# EAGLE design M7347B (EAGLE 6.6.0)
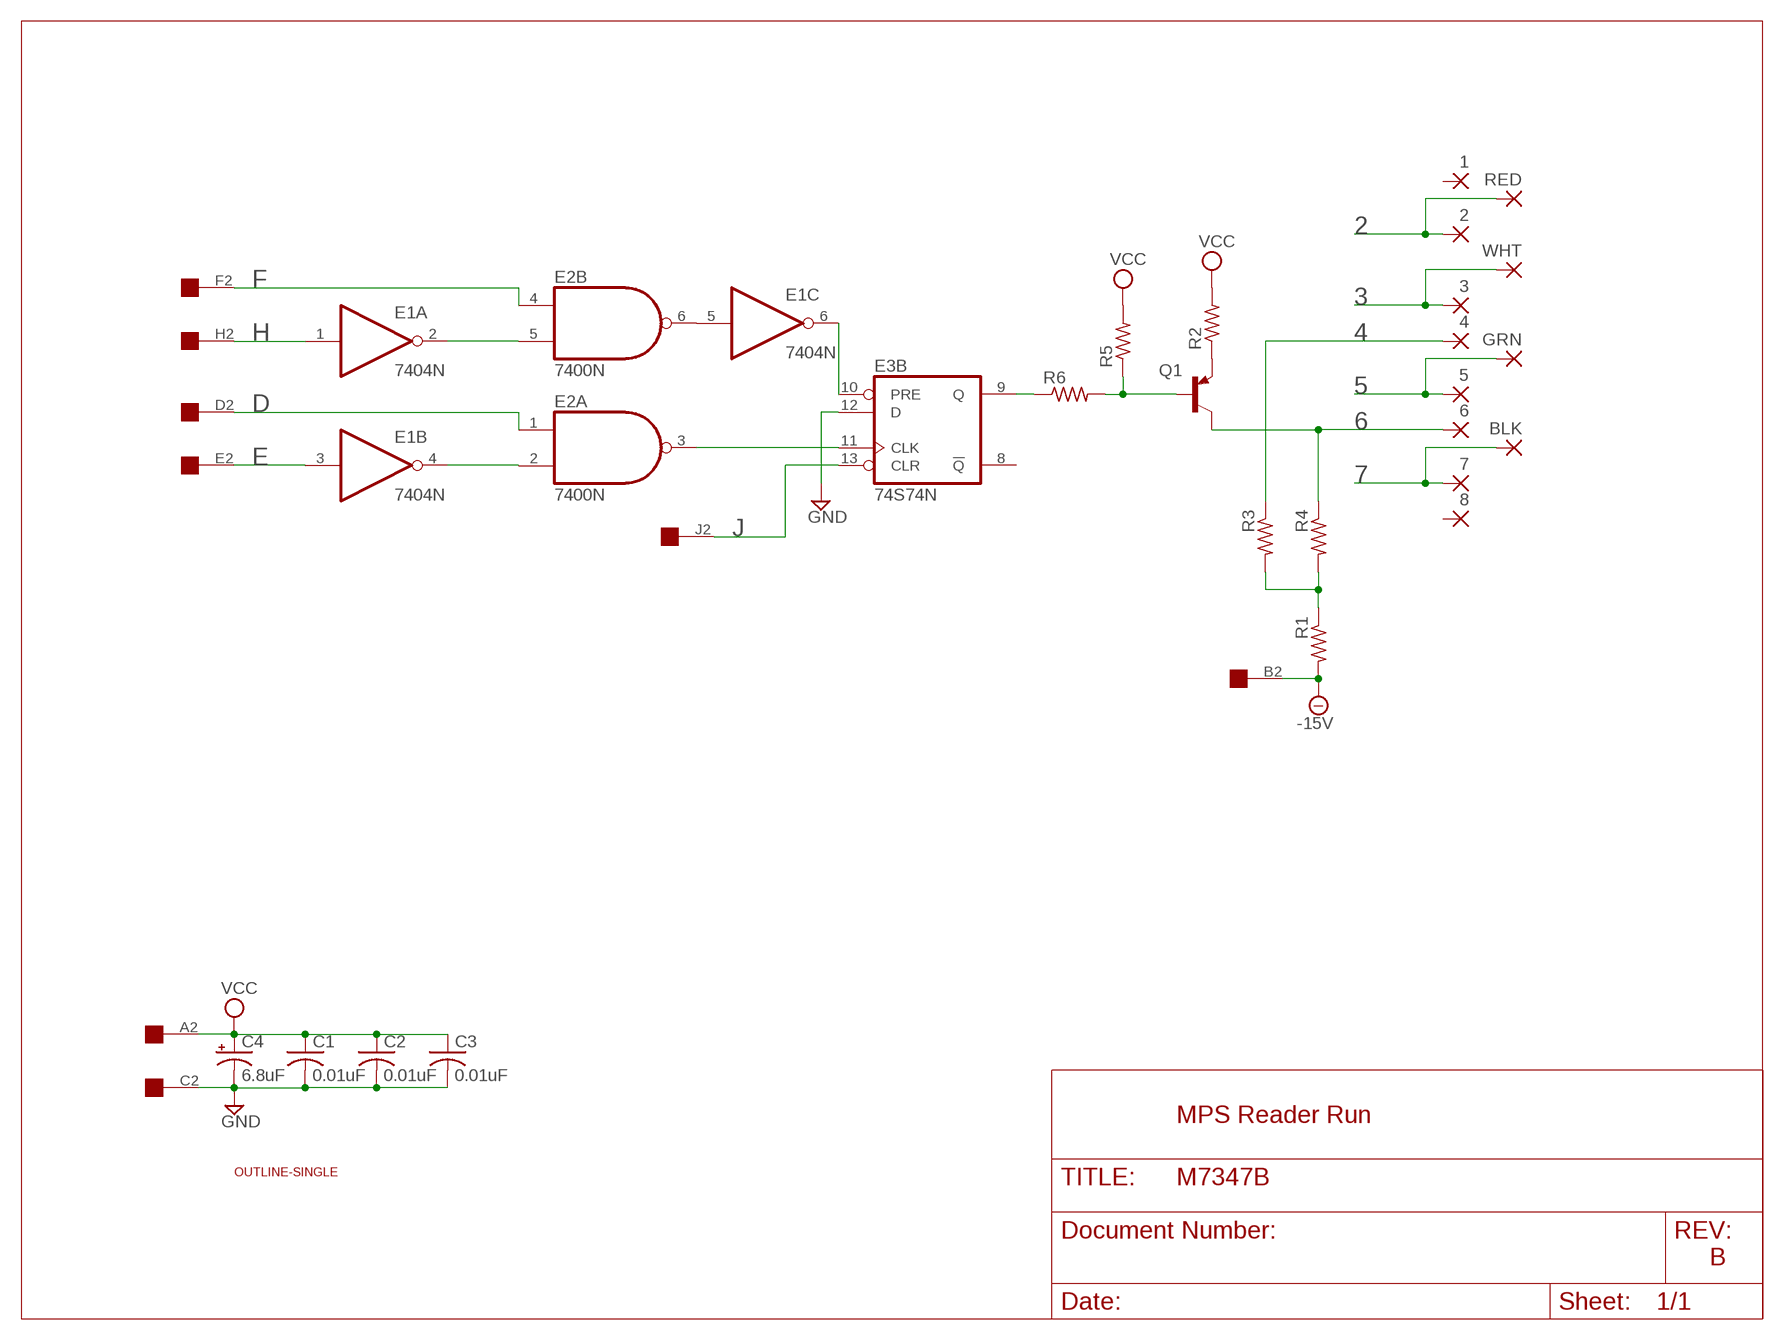
[diagram p0: schematic, sheet 1]

## Parts
1  2,15/1,0  [2,15/1,0]
2  2,15/1,0  [2,15/1,0]
3  2,15/1,0  [2,15/1,0]
4  2,15/1,0  [2,15/1,0]
5  2,15/1,0  [2,15/1,0]
6  2,15/1,0  [2,15/1,0]
7  2,15/1,0  [2,15/1,0]
8  2,15/1,0  [2,15/1,0]
BLK  2,15/1,0  [2,15/1,0]
C1  0.01uF  C-US050-025X075  [C050-025X075]
C2  0.01uF  C-US050-025X075  [C050-025X075]
C3  0.01uF  C-US050-025X075  [C050-025X075]
C4  6.8uF  CPOL-USE20-8AXIAL  [E12-8]
E1  7404N  [DIL14]
E2  7400N  [DIL14]
E3  74S74N  [DIL14]
GRN  2,15/1,0  [2,15/1,0]
Q1  -PNP-TO5  [TO5]
R1  R-US_0207/10  [0207/10]
R2  R-US_0207/10  [0207/10]
R3  R-US_0207/10  [0207/10]
R4  R-US_0207/10  [0207/10]
R5  R-US_0207/10  [0207/10]
R6  R-US_0207/10  [0207/10]
RED  2,15/1,0  [2,15/1,0]
U$1  EDGE-1  [EDGE-CON1]
U$2  OUTLINE-SINGLE  [SINGLE]
WHT  2,15/1,0  [2,15/1,0]

## Nets
2: 2.1(P) RED.1(P)
3: 3.1(P) WHT.1(P)
4: 4.1(P) R3.1
5: 5.1(P) GRN.1(P)
6: 6.1(P) Q1.3(C) R4.1
7: 7.1(P) BLK.1(P)
-15V [supply]: R1.2 U$1.B2
D: E2.1(A:I0) U$1.D2
E: E1.3(B:I) U$1.E2
F: E2.4(B:I0) U$1.F2
GND [supply]: C1.2 C2.2 C3.2 C4.- E3.12(B:D) U$1.C2
H: E1.1(A:I) U$1.H2
J: E3.13(B:CLR) U$1.J2
N$1: Q1.2(B) R5.1 R6.2
N$2: E1.2(A:O) E2.5(B:I1)
N$3: E1.4(B:O) E2.2(A:I1)
N$4: E1.6(C:O) E3.10(B:PRE)
N$6: E2.3(A:O) E3.11(B:CLK)
N$9: E1.5(C:I) E2.6(B:O)
N$26: E3.9(B:Q) R6.1
N$43: R1.1 R3.2 R4.2
N$44: Q1.1(E) R2.1
VCC [supply]: C1.1 C2.1 C3.1 C4.+ R2.2 R5.2 U$1.A2
Unconnected: 1.1(P) 8.1(P) E1.8(D:O) E1.9(D:I) E1.10(E:O) E1.11(E:I) E1.12(F:O) E1.13(F:I) E2.8(C:O) E2.9(C:I0) E2.10(C:I1) E2.11(D:O) E2.12(D:I0) E2.13(D:I1) E3.1(A:CLR) E3.2(A:D) E3.3(A:CLK) E3.4(A:PRE) E3.5(A:Q) E3.6(A:!Q) E3.8(B:!Q) U$1.K2 U$1.L2 U$1.M2 U$1.N2 U$1.P2 U$1.R2 U$1.S2 U$1.T2 U$1.U2 U$1.V2

## Notes on the sheet
- MPS Reader Run
- B

## Power pins joined to a net without a drawn wire
GND: E1.7(P:GND) E2.7(P:GND) E3.7(P:GND)
VCC: E1.14(P:VCC) E2.14(P:VCC) E3.14(P:VCC)

## Library data of the parts
1-8 BLK GRN RED WHT = wirepad:2,15/1,0: THROUGH-HOLE PAD
C1-C3 = rcl:C-US: CAPACITOR, American symbol
C4 = dec-con:CPOL-USE20-8AXIAL: A 0.8 inch electrolytic.
E1 = 74xx-us:74*04: Hex INVERTER
E2 = 74xx-us:74*00: Quad 2-input NAND gate
E3 = 74xx-us:74*74: Dual D type positive edge triggered FLIP FLOP, preset and clear
Q1 = transistor:*-PNP-: PNP Transistror
R1-R6 = rcl:R-US_: RESISTOR, American symbol
U$1 = dec-con:EDGE-1: Single-Sided DEC Edge Connector -- (side 2)
U$2 = dec-con:OUTLINE-*: Board outlines for DEC boards.

## Net classes
1 supply: width 0.813 mm

## Board
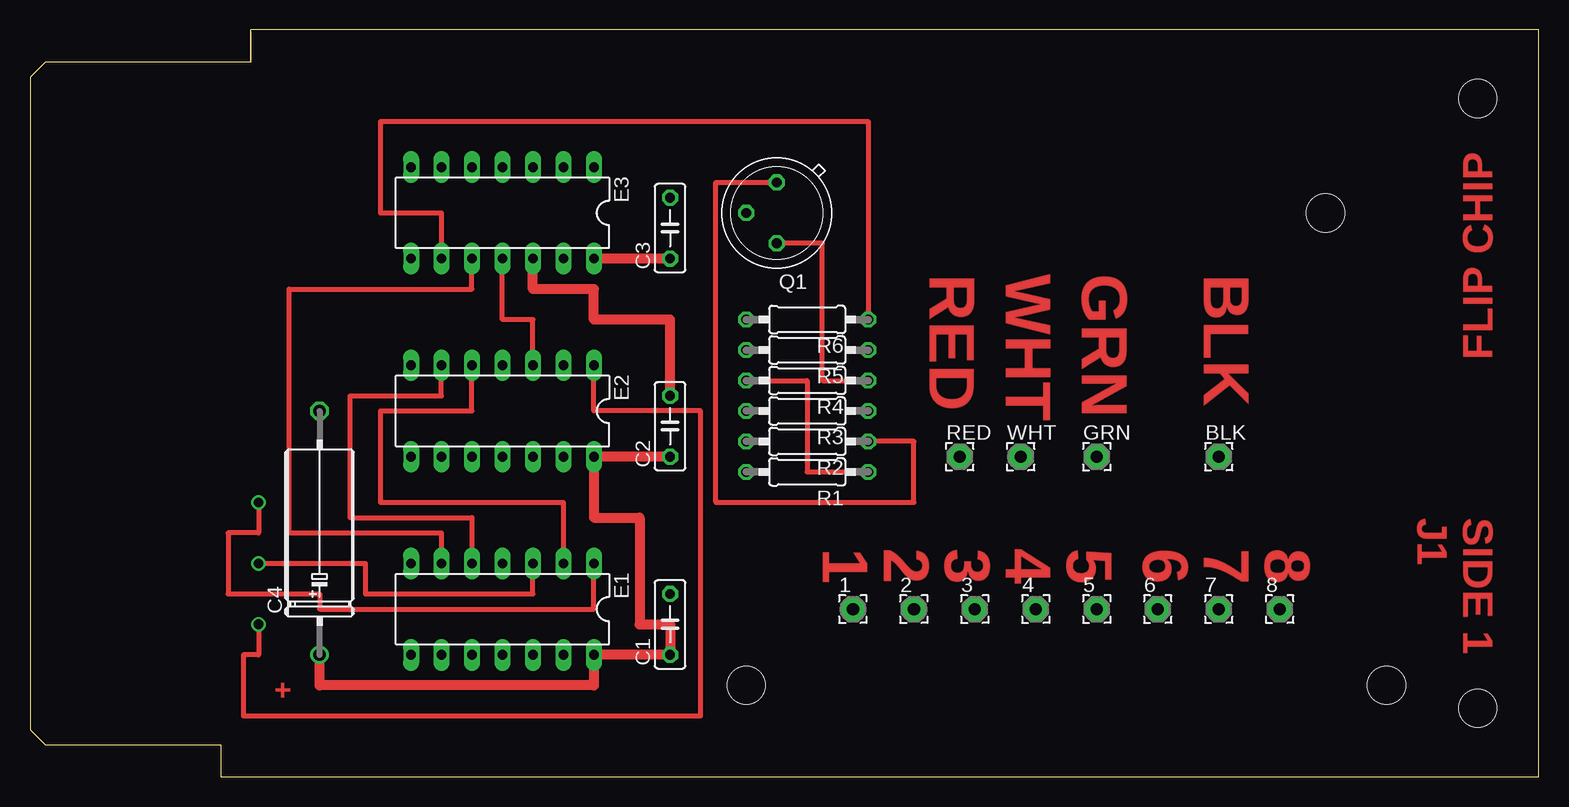
[diagram p1: board, top side]
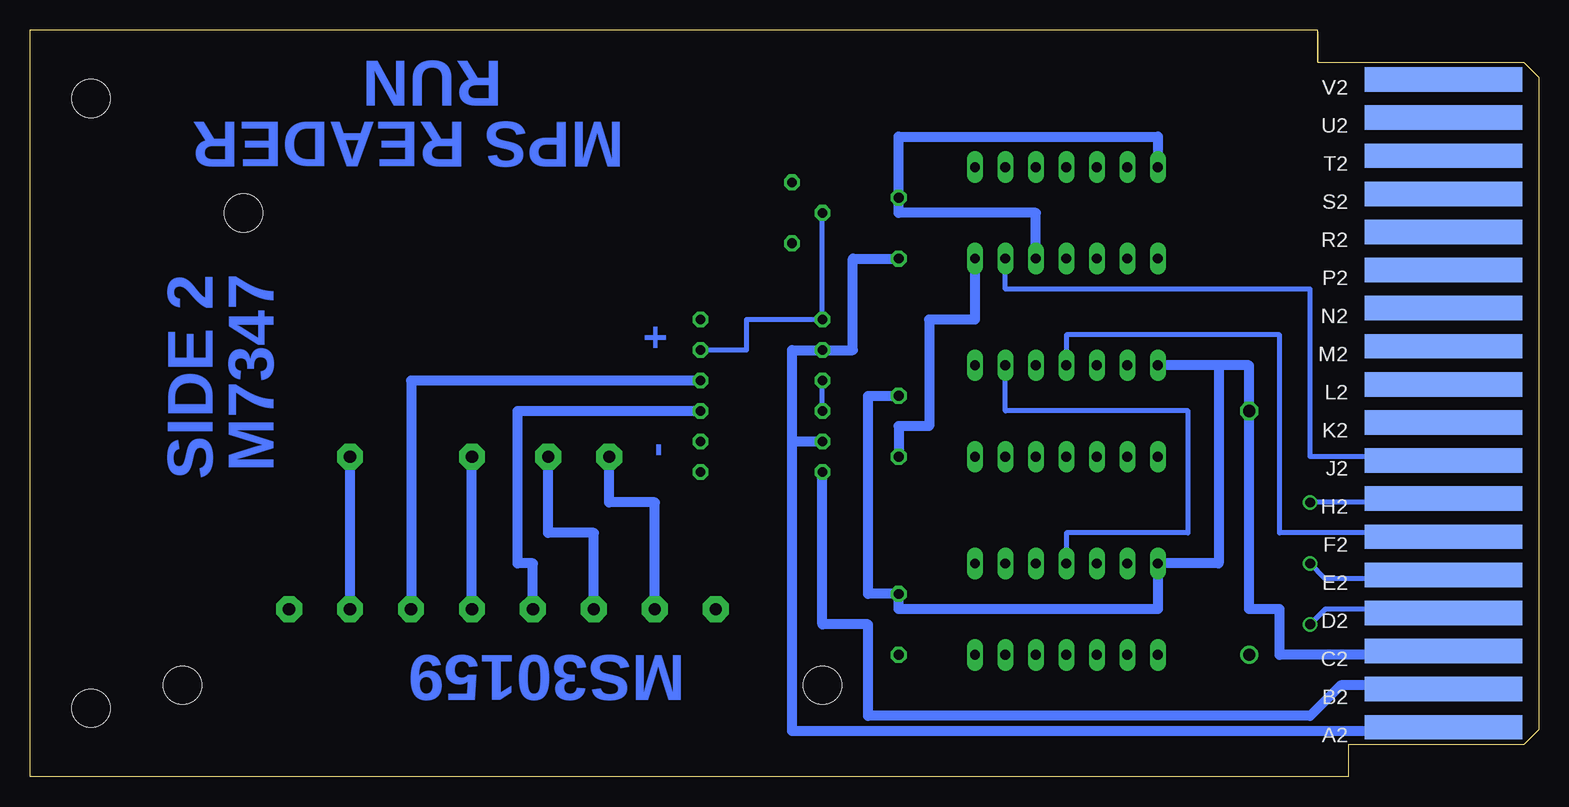
[diagram p2: board, bottom side, seen from below]

Size 125.73 x 62.23 mm. Coordinates in mm from the lower left corner, seen from the top.
Copper layers (1+16): Top 0.035mm / dielectric 1.5mm / Bottom 0.035mm
Design rules "16mils": minimum track width 16mil, minimum drill 32mil, track to track 15mil, track to pad 10mil, pad to pad 10mil, via to via 10mil, smd to smd 10mil, copper to edge 13mil, drill to drill 10mil, minimum pad ring 10mil, minimum via ring 8mil, stop-mask expansion 0mil, vias tented up to drill 0mil, thermal gap 10mil
Holes 3.17 mm at 107.95,46.99 113.03,7.62 59.69,7.62

### Footprints (pad centres in the part's own frame; a part is rotated, then mirrored left to right if it is on the bottom)
2,15/1,0 = drill 1.016 pad 2.159 octagon: 1 0,0
C050-025X075 = drill 0.813 octagon: 1 -2.54,0; 2 2.54,0
E12-8 = drill 1.016: + -10.16,0 | drill 1.016 octagon: - 10.16,0
DIL14 = drill 0.813 long: 1 -7.62,-3.81; 2 -5.08,-3.81; 3 -2.54,-3.81; 4 0,-3.81; 5 2.54,-3.81; 6 5.08,-3.81; 7 7.62,-3.81; 8 7.62,3.81; 9 5.08,3.81; 10 2.54,3.81; 11 0,3.81; 12 -2.54,3.81; 13 -5.08,3.81; 14 -7.62,3.81
TO5 = drill 0.813 octagon: 1 0,-2.54; 2 2.54,0; 3 0,2.54
0207/10 = drill 0.813 octagon: 1 -5.08,0; 2 5.08,0
EDGE-CON1 = smd 13.106 x 2.032 bottom: A2 7.938,4.128; B2 7.938,7.303; C2 7.938,10.477; D2 7.938,13.652; E2 7.938,16.828; F2 7.938,20.003; H2 7.938,23.177; J2 7.938,26.352; K2 7.938,29.527; L2 7.938,32.703; M2 7.938,35.877; N2 7.938,39.053; P2 7.938,42.227; R2 7.938,45.403; S2 7.938,48.578; T2 7.938,51.752; U2 7.938,54.928; V2 7.938,58.102
SINGLE = hole 3.175: 120.65,56.515; 120.65,5.715

### Placement (x,y rotation side)
1  68.58,13.97 0 top
2  73.66,13.97 0 top
3  78.74,13.97 0 top
4  83.82,13.97 0 top
5  88.9,13.97 0 top
6  93.98,13.97 0 top
7  99.06,13.97 0 top
8  104.14,13.97 0 top
BLK  99.06,26.67 0 top
C1  53.34,12.7 90 top
C2  53.34,29.21 90 top
C3  53.34,45.72 90 top
C4  24.13,20.32 90 top
E1  39.37,13.97 180 top
E2  39.37,30.48 180 top
E3  39.37,46.99 180 top
GRN  88.9,26.67 0 top
Q1  62.23,46.99 180 top
R1  64.77,25.4 180 top
R2  64.77,27.94 180 top
R3  64.77,30.48 180 top
R4  64.77,33.02 180 top
R5  64.77,35.56 180 top
R6  64.77,38.1 180 top
RED  77.47,26.67 0 top
U$1  0,0 0 top
U$2  0,0 0 top
U$3  [FLIPCHIP]  124.46,71.12 180 top  (outside the outline)
WHT  82.55,26.67 0 top

### Tracks (layer width: path | path; a pad name or v marks a point on that pad's centre or on a via)
2
  Bottom 0.813: RED.1 77.47,22.86 73.66,22.86 2.1
3
  Bottom 0.813: WHT.1 82.55,20.32 78.74,20.32 3.1
4
  Bottom 0.813: R3.1 85.09,30.48 85.09,17.78 83.82,17.78 4.1
5
  Bottom 0.813: 5.1 GRN.1
6
  Top 0.406: Q1.3 66.04,44.45 66.04,33.02 R4.1
  Bottom 0.813: R4.1 93.98,33.02 6.1
7
  Bottom 0.813: 7.1 BLK.1
-15V
  Bottom 0.813: U$1.B2 7.94,7.62 16.51,7.62 19.05,5.08 55.88,5.08 55.88,12.7 59.69,12.7 R1.2
D  (via drill 0.81)
  Top 0.406: v19.05,12.7 19.05,10.16 17.78,10.16 17.78,5.08 55.88,5.08 55.88,30.48 46.99,30.48 E2.1
  Bottom 0.406: U$1.D2 8.26,13.97 17.78,13.97 v19.05,12.7
E  (via drill 0.81)
  Top 0.406: v19.05,17.78 27.94,17.78 27.94,15.24 41.91,15.24 E1.3
  Bottom 0.406: U$1.E2 8.26,16.51 17.78,16.51 v19.05,17.78
F
  Bottom 0.406: U$1.F2 8.26,20.32 21.59,20.32 21.59,36.83 39.37,36.83 E2.4
GND
  Top 0.813: C2.2 53.34,38.1 46.99,38.1 46.99,40.64 41.91,40.64 E3.12
  Bottom 0.813: U$1.C2 8.26,10.16 21.59,10.16 21.59,13.97 24.13,13.97 C4.- 24.13,34.29 26.67,34.29 | 26.67,34.29 E2.7 | 26.67,34.29 26.67,17.78 E1.7 31.75,13.97 53.34,13.97 C1.2 55.88,15.24 55.88,31.75 C2.2 | E3.7 31.75,53.34 53.34,53.34 C3.2 53.34,46.99 41.91,46.99 E3.12
H  (via drill 0.81)
  Top 0.406: v19.05,22.86 19.05,20.32 16.51,20.32 16.51,15.24 24.13,15.24 24.13,13.97 46.99,13.97 E1.1
  Bottom 0.406: U$1.H2 8.26,22.86 v19.05,22.86
J
  Bottom 0.406: E3.13 44.45,40.64 19.05,40.64 19.05,26.67 8.26,26.67 U$1.J2
N$1
  Bottom 0.406: R5.1 66.04,35.56 66.04,38.1 R6.2 Q1.2
N$2
  Top 0.406: E1.2 44.45,22.86 29.21,22.86 29.21,30.48 36.83,30.48 E2.5
N$3
  Bottom 0.406: E1.4 39.37,20.32 29.21,20.32 29.21,30.48 44.45,30.48 E2.2
N$4
  Top 0.406: E1.6 34.29,20.32 21.59,20.32 21.59,40.64 36.83,40.64 E3.10
N$6
  Top 0.406: E2.3 41.91,38.1 39.37,38.1 E3.11
N$9
  Top 0.406: E1.5 36.83,21.59 26.67,21.59 26.67,31.75 34.29,31.75 E2.6
N$26
  Top 0.406: E3.9 34.29,46.99 29.21,46.99 29.21,54.61 69.85,54.61 R6.1
N$43
  Top 0.406: R4.2 64.77,33.02 64.77,25.4 R1.1
  Bottom 0.406: R3.2 R4.2
N$44
  Top 0.406: Q1.1 57.15,49.53 57.15,22.86 73.66,22.86 73.66,27.94 R2.1
VCC
  Top 0.813: C4.+ 24.13,7.62 46.99,7.62 E1.14 C1.1 53.34,12.7 50.8,12.7 50.8,21.59 46.99,21.59 E2.14 C2.1 | C3.1 E3.14
  Bottom 0.813: U$1.A2 8.26,3.81 62.23,3.81 62.23,27.94 | 62.23,27.94 R2.2 | 62.23,27.94 62.23,35.56 R5.2 57.15,35.56 57.15,43.18 C3.1 | C2.1 53.34,29.21 50.8,29.21 50.8,38.1 46.99,38.1 E3.14

### Text on the board
Top: RED | WHT | GRN | BLK | J1 | SIDE 1 | 1 | 2 | 3 | 4 | 5 | 6 | 7 | 8 | +
Bottom: RUN | MPS READER | M7347 | SIDE 2 | + | - | MS30159